# EAGLE design DOORLOCK_v2 (EAGLE 7.5.0)

## Sheet 1 of 2
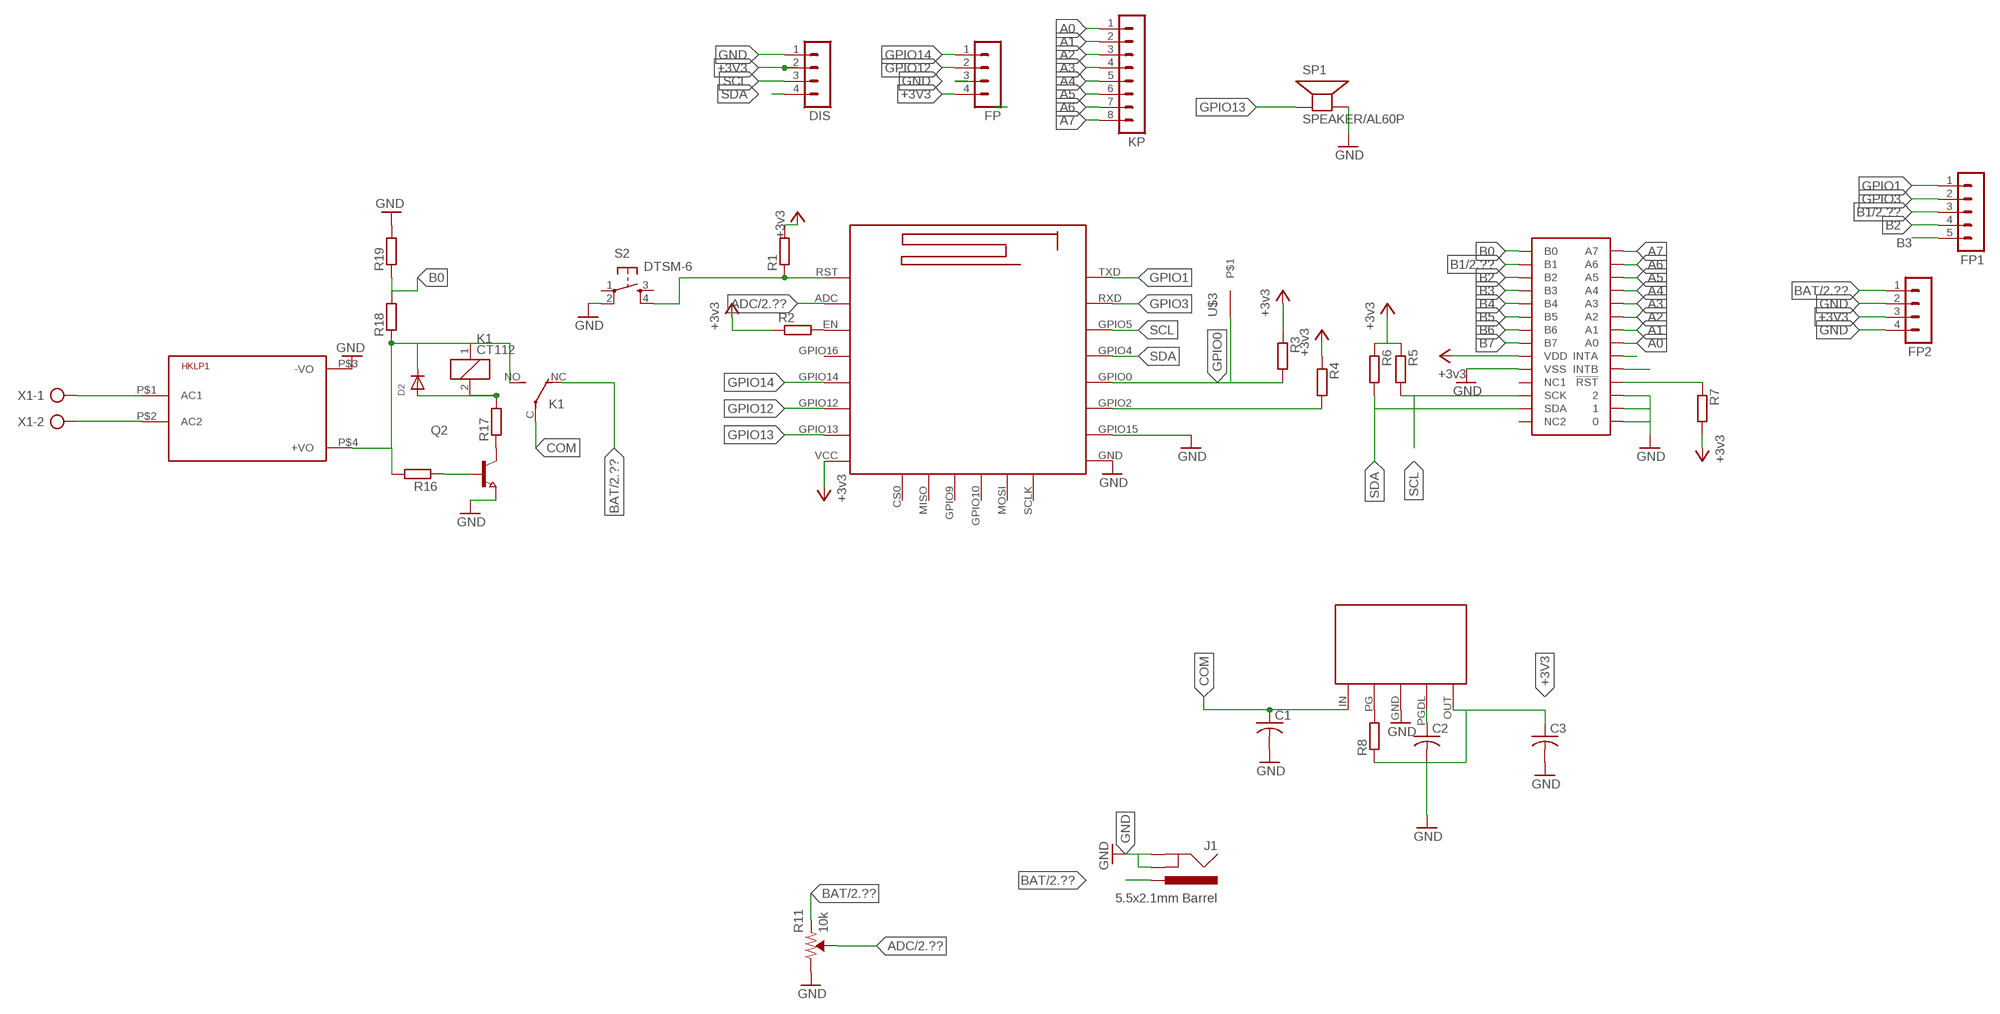
[diagram p0: schematic, sheet 1]

### Parts
C1  C-USC1206  [C1206]
C2  C-USC1206  [C1206]
C3  C-USC1206  [C1206]
D2  DIODESOD-123  [SOD-123]
DIS  MA04-1  [MA04-1]
FP  MA04-1  [MA04-1]
FP1  MA05-1  [MA05-1]
FP2  MA04-1  [MA04-1]
HKLP1  HKLPM01  [HKLPM01]
J1  5.5x2.1mm Barrel  POWER_JACKSMD  [POWER_JACK_SMD]
K1  CT112  [CT-SLIM]
KP  MA08-1  [MA08-1]
Q2  NPN-TRANSISTOR_SOT89  [SOT89]
R1  R-EU_0204/2V  [0204V]
R2  R-EU_0204/2V  [0204V]
R3  R-EU_0204/2V  [0204V]
R4  R-EU_0204/2V  [0204V]
R5  R-EU_0204/2V  [0204V]
R6  R-EU_0204/2V  [0204V]
R7  R-EU_0204/2V  [0204V]
R8  R-EU_0204/2V  [0204V]
R11  10k  TRIMPOT-SMD-3MM-OPEN-1/10W-25%  [TRIMPOT-SMD-TC33X]
R16  R-EU_0204/2V  [0204V]
R17  R-EU_0204/2V  [0204V]
R18  R-EU_0204/2V  [0204V]
R19  R-EU_0204/2V  [0204V]
S2  DTSM-6  [DTSM-6]
SP1  SPEAKER/AL60P  [AL60P]
U$1  ESP12E  [ESP-12E]
U$2  MCF23017  [MAX23017]
U$3  M1  [M1]
U$4  MP2014  [MP2014]
X1  AK500/2-H  [AK500/2-H]

### Nets
+3V3 [GPIO]: C3.1 DIS.2 FP2.3 FP.4 R1.2 R2.1 R3.1 R4.1 R5.1 R6.1 R7.2 R8.1 U$1.VCC U$2.P$9(VDD) U$4.OUT ; supply symbol labelled +3v3
+12V: D2.C HKLP1.P$4(+VO) K1.1 K1.NO(2:S) R16.2 R18.1 ; also sheet 2
A0 [GPIO]: KP.1 U$2.P$21(A0)
A1 [GPIO]: KP.2 U$2.P$22(A1)
A2 [GPIO]: KP.3 U$2.P$23(A2)
A3 [GPIO]: KP.4 U$2.P$24(A3)
A4 [GPIO]: KP.5 U$2.P$25(A4)
A5 [GPIO]: KP.6 U$2.P$26(A5)
A6 [GPIO]: KP.7 U$2.P$27(A6)
A7 [GPIO]: KP.8 U$2.P$28(A7)
ADC [GPIO]: R11.2(WIPER) U$1.ADC ; also sheet 2
B0 [GPIO]: R18.2 R19.1 U$2.P$1(B0)
B1 [GPIO]: FP1.3 U$2.P$2(B1) ; also sheet 2
B2 [GPIO]: FP1.4 U$2.P$3(B2)
B3 [GPIO]: FP1.5 U$2.P$4(B3)
B4 [GPIO]: U$2.P$5(B4)
B5 [GPIO]: U$2.P$6(B5)
B6 [GPIO]: U$2.P$7(B6)
B7 [GPIO]: U$2.P$8(B7)
BAT [GPIO]: FP2.1 J1.VIN0(PWR) K1.NC(2:O) R11.3(CCW) ; also sheet 2
COM: C1.1 K1.C(2:P) U$4.IN
GND [GPIO]: C1.2 C2.2 C3.2 DIS.1 FP2.2 FP2.4 FP.3 HKLP1.P$3(-VO) J1.GND(GNDBREAK) J1.P$4(GND) Q2.3(E) R11.1(CW) R19.2 S2.2 SP1.2(-) U$1.GND U$1.GPIO15 U$2.P$10(VSS) U$2.P$15 U$2.P$16 U$2.P$17 U$4.GND ; also sheet 2
GPIO0 [GPIO]: R3.2 U$1.GPIO0 U$3.P$1
GPIO1 [GPIO]: FP1.1 U$1.TXD
GPIO3 [GPIO]: FP1.2 U$1.RXD
GPIO12 [GPIO]: FP.2 U$1.GPIO12
GPIO13 [GPIO]: SP1.1(+) U$1.GPIO13
GPIO14 [GPIO]: FP.1 U$1.GPIO14
N$1 [GPIO]: R1.1 S2.4 U$1.RST
N$2: R2.2 U$1.EN
N$3 [AC]: HKLP1.P$1(AC1) X1.1
N$4 [GPIO]: R4.2 U$1.GPIO2
N$7 [AC]: HKLP1.P$2(AC2) X1.2
N$9: R7.1 U$2.P$18(!RST)
N$10: U$2.P$19(INTB)
N$11: U$2.P$20(INTA)
N$12: R8.2 U$4.PG
N$13: C2.1 U$4.PGDL
N$15: Q2.1(B) R16.1
N$16: Q2.2(C) R17.1
N$26: D2.A K1.2 R17.2
SCL [GPIO]: DIS.3 R5.2 U$1.GPIO5 U$2.P$12(SCK)
SDA [GPIO]: DIS.4 R6.2 U$1.GPIO4 U$2.P$13(SDA)
Unconnected: S2.1 S2.3 U$1.CS0 U$1.GPIO9 U$1.GPIO10 U$1.GPIO16 U$1.MISO U$1.MOSI U$1.SCLK U$2.P$11(NC1) U$2.P$14(NC2)

## Sheet 2 of 2
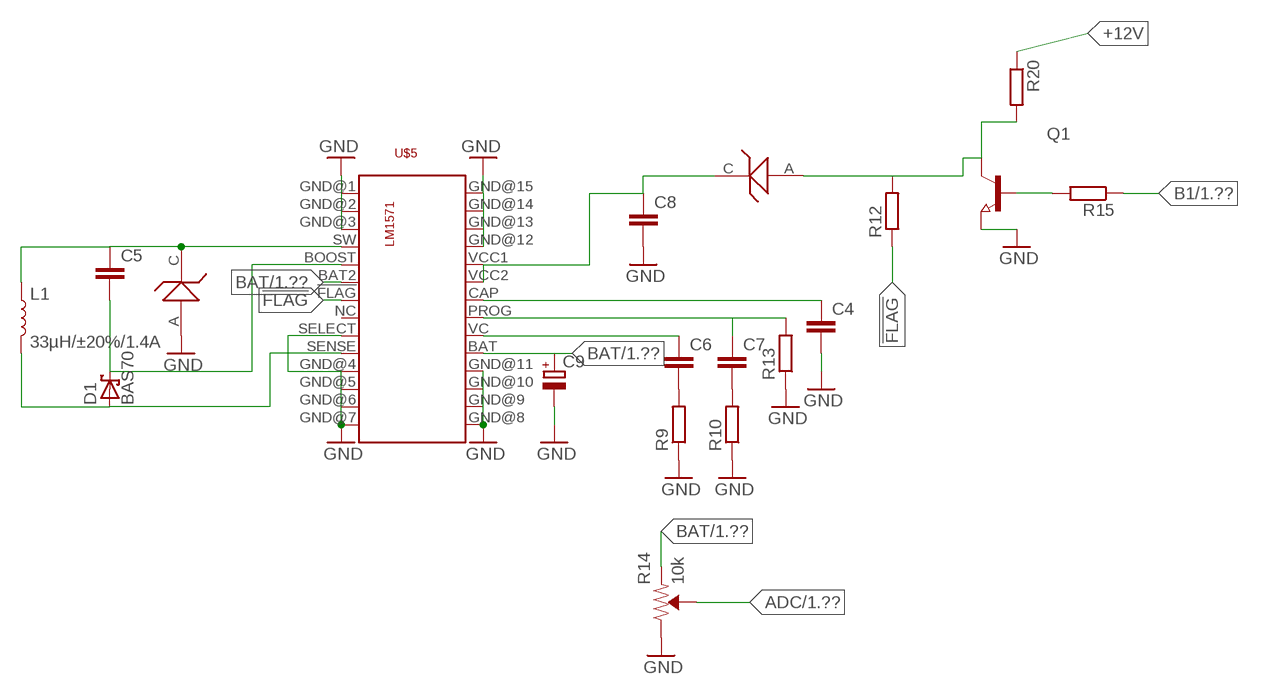
[diagram p1: schematic, sheet 2]

### Parts
C4  C-EUC0805  [C0805]
C5  C-EUC0805  [C0805]
C6  C-EUC0805  [C0805]
C7  C-EUC0805  [C0805]
C8  C-EUC0805  [C0805]
C9  CPOL-EUCT3216  [CT3216]
D1  BAS70  [SOT23]
D3  MBRM120T3  [MBRM120T3]
L1  33µH/±20%/1.4A  INDUCTOR-SRN6045-33UH  [SRN6045]
Q1  NPN-TRANSISTOR_SOT89  [SOT89]
R9  R-EU_0204/2V  [0204V]
R10  R-EU_0204/2V  [0204V]
R12  R-EU_0204/2V  [0204V]
R13  R-EU_0204/2V  [0204V]
R14  10k  TRIMPOT-SMD-3MM-OPEN-1/10W-25%  [TRIMPOT-SMD-TC33X]
R15  R-EU_0204/2V  [0204V]
R20  R-EU_0204/2V  [0204V]
U$5  LM1571  [LT1571]
U$6  MBRM120T3  [MBRM120T3]

### Nets
!FLAG [GPIO]: R12.1 U$5.!FLAG
+12V: R20.1 ; also sheet 1
ADC [GPIO]: R14.2(WIPER) ; also sheet 1
B1 [GPIO]: R15.1 ; also sheet 1
BAT [GPIO]: C9.+ R14.3(CCW) U$5.BAT U$5.BAT2 ; also sheet 1
GND [GPIO]: C4.2 C8.2 C9.- Q1.3(E) R9.1 R10.1 R13.1 R14.1(CW) U$5.GND@1 U$5.GND@2 U$5.GND@3 U$5.GND@4 U$5.GND@5 U$5.GND@6 U$5.GND@7 U$5.GND@8 U$5.GND@9 U$5.GND@10 U$5.GND@11 U$5.GND@12 U$5.GND@13 U$5.GND@14 U$5.GND@15 U$5.SELECT U$6.A ; also sheet 1
N$8 [GPIO]: Q1.1(B) R15.2
N$14: C8.1 D3.C U$5.VCC1 U$5.VCC2
N$17 [GPIO]: C4.1 U$5.CAP
N$18: D3.A Q1.2(C) R12.2 R20.2
N$19: D1.1(A) L1.2 U$5.SENSE
N$20: C5.1 L1.1 U$5.SW U$6.C
N$21: C5.2 D1.3(C) U$5.BOOST
N$22: C6.2 R9.2
N$23: C6.1 U$5.VC
N$24: C7.2 R10.2
N$25: C7.1 R13.2 U$5.PROG
Unconnected: U$5.NC

## Library data of the parts
C1-C3 = adafruit:C-US: CAPACITOR, American symbol
C4-C8 = rcl:C-EU: CAPACITOR, European symbol
C9 = rcl:CPOL-EU: POLARIZED CAPACITOR, European symbol
D1 = diode:BAS70: Silicon Schottky Diodes General-purpose diode for high-speed switching
D2 = adafruit:DIODE: Diode SMADIODE - SMA Surface Mount Package 20V 1A Schottky Diode Digikey: 641-1014-6-ND DO-1N4148 - Through Hole Small Current Diode SOD-123 20V 1 A (.5mV Vf) Schottky Diode - Digikey: MBRX120TPMSCT-ND SOD-323 10V 570mA (.38mV Vf, 3ns) Schottky Diode - Digikey: ZLLS410CT-ND SOD-523 30V 30mA Schottky Diode (RB751S-40TE61) - Digikey: RB751S-40TE61CT-ND SOT23-R/W - SOT23 Package (R = Solder Paste/Reflow Ovens, W = Hand-Soldering) BAT54Film 40V 300mA - Digikey: 497-7162-1-ND
D3 U$6 = Alfred:MBRM120T3
DIS FP FP2 = con-lstb:MA04-1: PIN HEADER; OC_FARNELL: unknown; OC_NEWARK: unknown
FP1 = con-lstb:MA05-1: PIN HEADER; OC_FARNELL: unknown; OC_NEWARK: unknown
HKLP1 = HKLPM01:HKLPM01
J1 = SparkFun-Connectors:POWER_JACK: Power Jack Connector This is the standard 5.5mm barrel jack for power. The PTH is the most common, proven, reliable, footprint. The Slot footprint only works if the mill layer is transmitted to the PCB fab house so be warned. Here are the connectors we sell at SparkFun: DC Barrel Power Jack/Connector <https://www.sparkfun.com/products/119> (PRT-00119) DC Barrel Power Jack/Connector (SMD) <https://www.sparkfun.com/products/12748> (PRT-12748) DC Barrel Jack Adapter - Breadboard Compatible <https://www.sparkfun.com/products/10811> (PRT-10811) It is used on this SparkFun product (and many, many others): SparkFun RedBoard - Programmed with Arduino <https://www.sparkfun.com/products/12757> (DEV-12757) Also, if you need a mating power supply or connector, please check these out: Wall Adapter Power Supply - 9VDC 650mA <https://www.sparkfun.com/products/298> (TOL-00298) DC Barrel Jack Adapter - Male <https://www.sparkfun.com/products/10287> (PRT-10287); PROD_ID: CONN-08106; SF_ID: PRT-12748
K1 = relay:CT112: ULTRA SMALL AUTOMOTIVE RELAY NAiS Slim 1c type en_ds_61205_0000.pdf; OC_FARNELL: unknown; OC_NEWARK: unknown
KP = con-lstb:MA08-1: PIN HEADER; OC_FARNELL: unknown; OC_NEWARK: unknown
L1 = SparkFun-Coils:INDUCTOR: Inductors Resist changes in electrical current. Basically a coil of wire. SparkFun Products: SparkFun Load Cell Amplifier - HX711 <https://www.sparkfun.com/products/13879> IOIO-OTG - V2.2 <https://www.sparkfun.com/products/13613>; PROD_ID: NDUC-11627
Q1 Q2 = semicon-smd-ipc:NPN-TRANSISTOR_: NPN TRANSISTOR
R1-R8 R16-R19 = resistor:R-EU_: RESISTOR, European symbol
R9 R10 R12 R13 R15 R20 = rcl:R-EU_: RESISTOR, European symbol
R11 R14 = SparkFun-Resistors:TRIMPOT: Trimming Potentiometer (Trimpot) Three-terminal potentiometers, with an adjustable wiper and two adjustable resistors. A pot can be used to create a configurable voltage divider, or as a variable resistor. "Trimpots" are a subset of potentiometers, usually intended for "set-and-forget" applications. They're often more delicate than standard potentiometers - rated for fewer turns. Variants PTH-KNOB - PTH Trimpot w/ finger-adjustable knob Trimpot 10K with Knob <https://www.sparkfun.com/products/9806> (COM-09806) Datasheet <http://www.sparkfun.com/datasheets/Components/General/TSR-3386.pdf> SMD-3MM-CLOSED-FRAME - SMD 3mm Square Closed-Frame Trimpot Used on e.g. EasyDriver - Stepper Motor Driver <https://www.sparkfun.com/products/12779> Datasheet <http://www.bitechnologies.com/pdfs/22.pdf> (22AR10KTR) SMD-5MM - SMD 5mm Square Closed-Frame Trimpot Used on e.g. IOIO-OTG - V2.2 <https://www.sparkfun.com/products/13613> Datasheet <http://www.vishay.com/docs/51008/ts53.pdf> (TS53YL502MR10) SMD-3MM-1/10W-25% - 3mm Square Open-Frame Trimpot Used on e.g. SparkFun Shapeoko <https://www.sparkfun.com/products/13899> Datasheet <http://www.bourns.com/docs/Product-Datasheets/TC33.pdf> (TC33X-2-103E); PROD_ID: RES-12428, RES-08048
S2 = switch-tact:DTSM-6
SP1 = adafruit:SPEAKER: SPEAKER Source: Buerklin Added PS12 (for part # PS1240 piezo) http://www.ladyada.net/library/pcb/eaglelibrary.html
U$1 = Alfred:ESP12E
U$2 = Alfred:MCF23017
U$3 = Alfred:M1
U$4 = Alfred:MP2014
U$5 = Alfred:LM1571
X1 = con-ptr500:AK500/2-H: CONNECTOR Aug. 2004 / PTR Meßtechnik: Die Bezeichnung der Serie AK505 wurde geändert. Es handelt sich hierbei um AK500 in horizontaler Ausführung.; OC_FARNELL: unknown; OC_NEWARK: unknown

## Net classes
0 default: width 0.5 mm, drill 0.4 mm, clearance 0.2 mm
1 AC: width 1 mm, drill 0.4 mm, clearance 1 mm to class 0, clearance 1 mm
2 GPIO: width 0.2 mm, drill 0.4 mm, clearance 0.2 mm to class 0, clearance 1 mm to class 1, clearance 0.2 mm

## Board
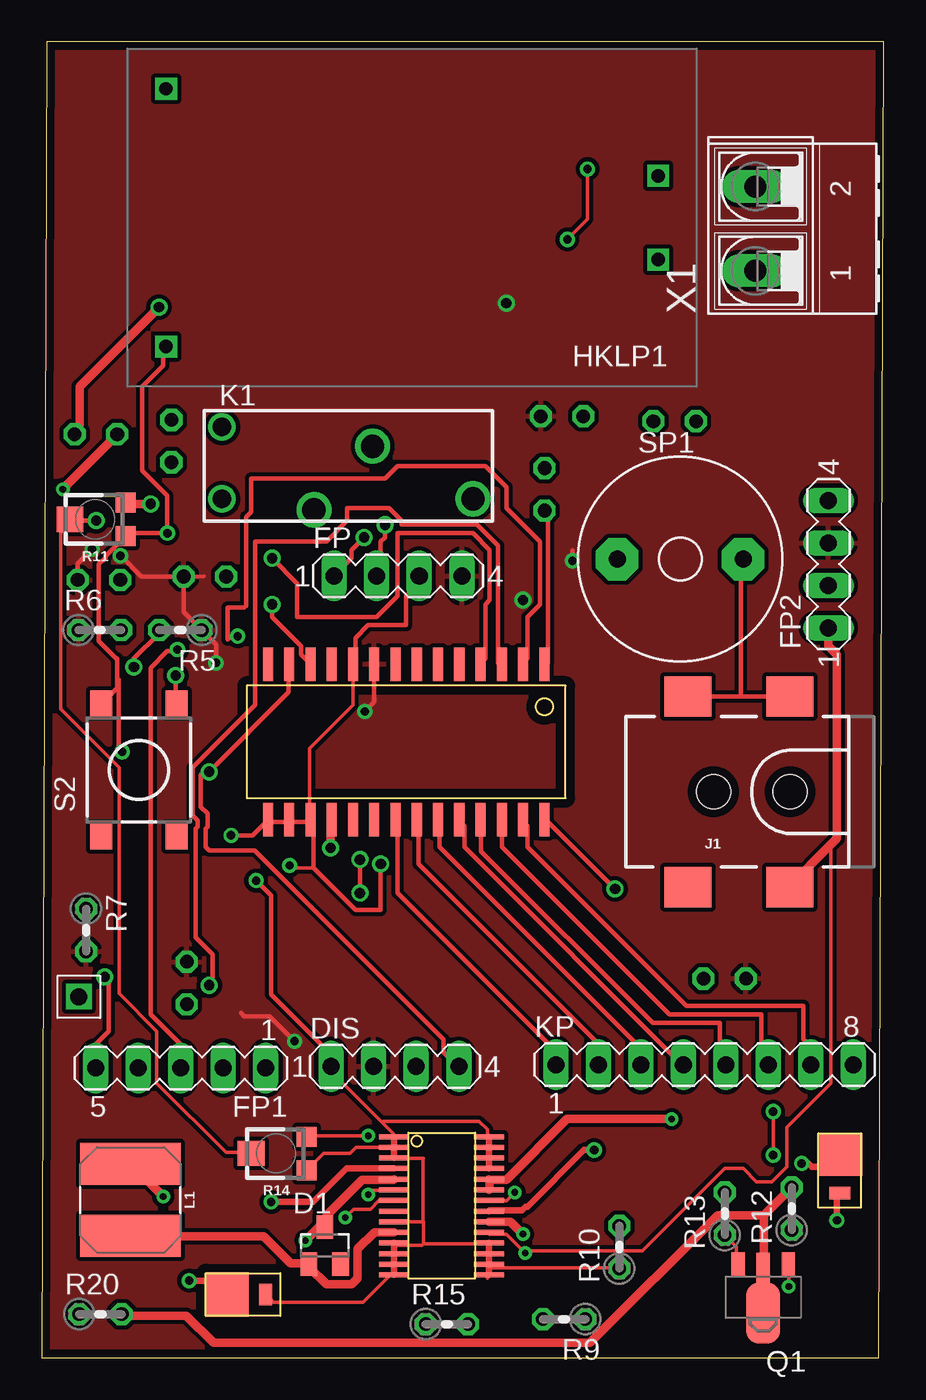
[diagram p2: board, top side]
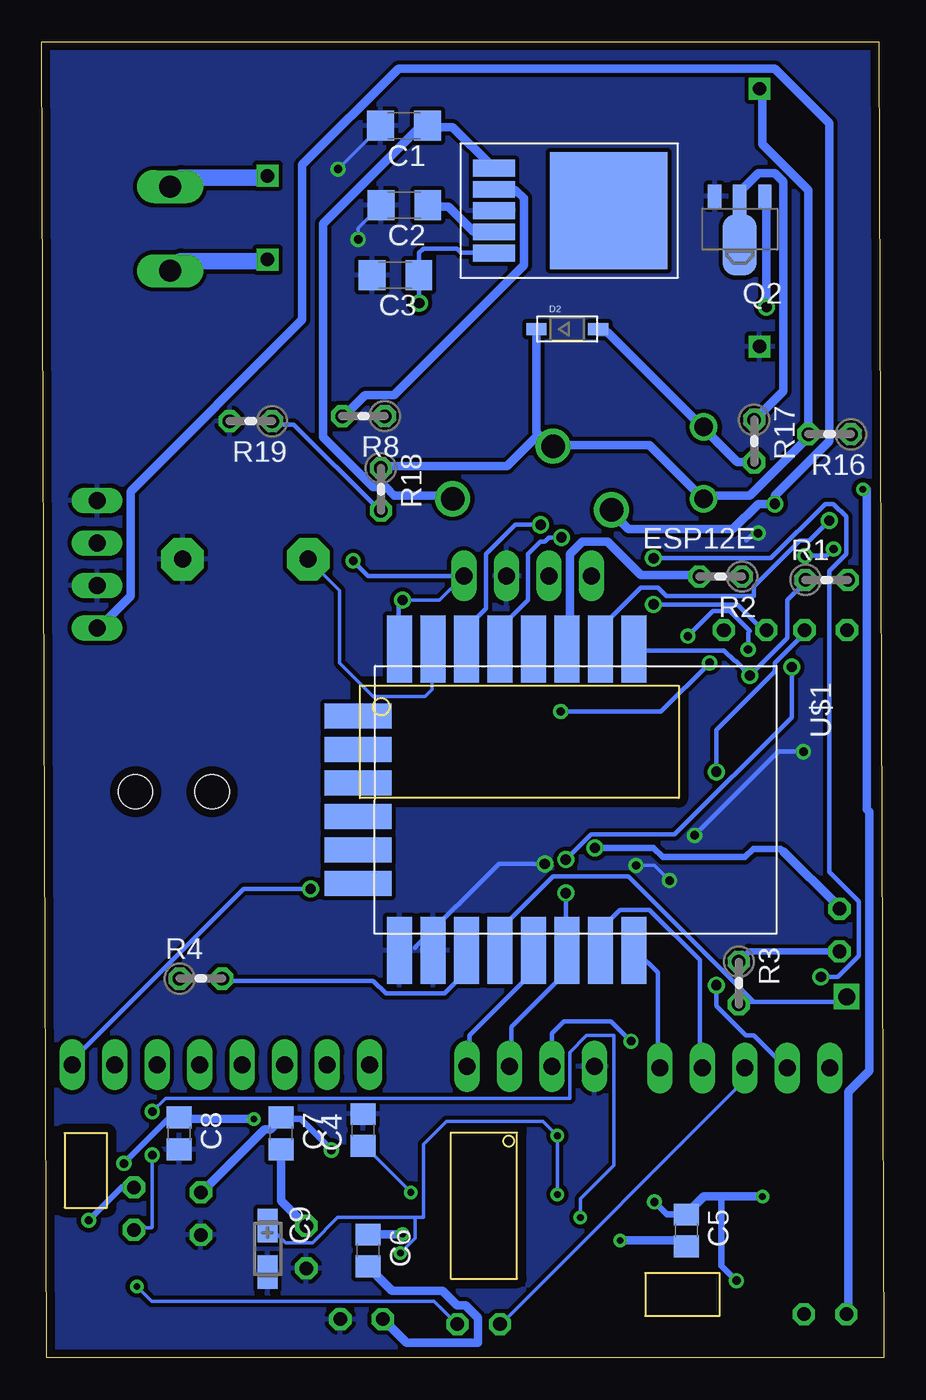
[diagram p3: board, bottom side, seen from below]

Size 50.3 x 78.6 mm. Coordinates in mm from the lower left corner, seen from the top.
Outline: 0,0 50,0 50.3,78.6 0.3,78.6 0,0
Copper layers (1*16): Top 0.035mm / dielectric 1.5mm / Bottom 0.035mm
Design rules "default *": minimum track width 0.2mm, minimum drill 0.4mm, track to track 0.2mm, track to pad 0.2mm, pad to pad 0.2mm, via to via 0.2mm, smd to smd 8mil, copper to edge 0.5mm, drill to drill 8mil, minimum pad ring 10mil, minimum via ring 8mil, stop-mask expansion 4mil, vias tented up to drill 0mil, thermal gap 10mil
Holes 3 mm at 59,75 66,72

### Footprints (pad centres in the part's own frame; a part is rotated, then mirrored left to right if it is on the bottom)
C1206 = smd 1.6 x 1.8: 1 -1.4,0; 2 1.4,0
C0805 = smd 1.3 x 1.5: 1 -0.95,0; 2 0.95,0
CT3216 = smd 2 x 1.2: + -1.4,0; - 1.4,0
SOT23 = smd 1 x 1.4: 1 -0.95,-1.1; 2 0.95,-1.1; 3 0,1.1
SOD-123 = smd 1.2 x 0.7: A 1.85,0; C -1.85,0
MBRM120T3 = smd 0.762 x 1.27: A 3.575,1.27 | smd 2.54 x 2.67: C 1.27,1.27
MA04-1 = drill 1.016 long: 1 -3.81,0; 2 -1.27,0; 3 1.27,0; 4 3.81,0
MA05-1 = drill 1.016 long: 1 -5.08,0; 2 -2.54,0; 3 0,0; 4 2.54,0; 5 5.08,0
HKLPM01 = drill 0.8 square: P$1 -14.7,2.5; P$2 -14.7,-2.5; P$3 14.7,7.7; P$4 14.7,-7.7
POWER_JACK_SMD = smd 2.8 x 2.4: GND 0,-5.7; P$4 6.1,-5.7; VIN0 0,5.7; VIN1 6.1,5.7 | hole 2.032: 0,0; 4.572,0
CT-SLIM = drill 1.1: 1 -7.45,0; 2 -7.45,4.3 | drill 1.4: C 7.55,0; NC -1.95,-0.65; NO 1.55,3.15
MA08-1 = drill 1.016 long: 1 -8.89,0; 2 -6.35,0; 3 -3.81,0; 4 -1.27,0; 5 1.27,0; 6 3.81,0; 7 6.35,0; 8 8.89,0
SRN6045 = smd 2.5 x 6: 1 -2.175,0; 2 2.125,0
SOT89 = smd 0.8 x 1.4: 1 -1.499,-1.981; 3 1.499,-1.981 | smd 0.8 x 1.9: 2 0,-1.727 | smd 2.032 x 3.65: 2@1 0,0.94
0204V = drill 0.813 octagon: 1 -1.27,0; 2 1.27,0
TRIMPOT-SMD-TC33X = smd 1.2 x 1.2: 1 -1,-1.825; 3 1,-1.825 | smd 1.5 x 1.6: 2 0,1.5
DTSM-6 = smd 1.55 x 1.3: 1 -3.975,2.25; 2 3.975,2.25; 3 -3.975,-2.25; 4 3.975,-2.25
AL60P = drill 1.016 pad 2.54 octagon: 1 -3.759,0; 2 3.759,0
ESP-12E = smd 4 x 1.5: ADC -1,13.48; EN -1,11.48; GND 17,1.48; GPIO0 17,7.48; GPIO2 17,5.48; GPIO4 17,9.48; GPIO5 17,11.48; GPIO12 -1,5.48; GPIO13 -1,3.48; GPIO14 -1,7.48; GPIO15 17,3.48; GPIO16 -1,9.48; RST -1,15.48; RXD 17,13.48; TXD 17,15.48; VCC -1,1.48 | smd 1.5 x 4: CS0 3,-1; GPIO9 7,-1; GPIO10 9,-1; MISO 5,-1; MOSI 11,-1; SCLK 13,-1
MAX23017 = smd 0.6 x 2: P$1 0,0; P$2 1.27,0; P$3 2.54,0; P$4 3.81,0; P$5 5.08,0; P$6 6.35,0; P$7 7.62,0; P$8 8.89,0; P$9 10.16,0; P$10 11.43,0; P$11 12.7,0; P$12 13.97,0; P$13 15.24,0; P$14 16.51,0; P$15 16.51,9.3; P$16 15.24,9.3; P$17 13.97,9.3; P$18 12.7,9.3; P$19 11.43,9.3; P$20 10.16,9.3; P$21 8.89,9.3; P$22 7.62,9.3; P$23 6.35,9.3; P$24 5.08,9.3; P$25 3.81,9.3; P$26 2.54,9.3; P$27 1.27,9.3; P$28 0,9.3
M1 = drill 1.016 square: P$1 0,0
MP2014 = smd 1 x 2.5: GND 0,0; IN -2.54,0; OUT 2.54,0; PG -1.27,0; PGDL 1.27,0 | smd 7 x 7: P$6 0,6.85
LT1571 = smd 0.3 x 1.8: !FLAG 3.81,-0.864; BAT 5.715,4.809; BAT2 3.175,-0.864; BOOST 2.54,-0.864; CAP 3.81,4.809; GND@1 0,-0.864; GND@2 0.635,-0.864; GND@3 1.27,-0.864; GND@4 6.35,-0.864; GND@5 6.985,-0.864; GND@6 7.62,-0.864; GND@7 8.255,-0.864; GND@8 8.255,4.809; GND@9 7.62,4.809; GND@10 6.985,4.809; GND@11 6.35,4.809; GND@12 1.905,4.809; GND@13 1.27,4.809; GND@14 0.635,4.809; GND@15 0,4.809; NC 4.445,-0.864; PROG 4.445,4.809; SELECT 5.08,-0.864; SENSE 5.715,-0.864; SW 1.905,-0.864; VC 5.08,4.809; VCC1 2.54,4.809; VCC2 3.175,4.809
AK500/2-H = drill 1.321 long: 1 -2.515,0; 2 2.515,0

### Placement (x,y rotation side)
C1  28.66,73.59 180 bottom
C2  28.64,68.84 180 bottom
C3  29.18,64.66 180 bottom
C4  31.1,13.6 90 bottom
C5  11.8,7.6 270 bottom
C6  30.8,6.4 270 bottom
C7  36,13.4 270 bottom
C8  42.1,13.4 270 bottom
C9  36.8,6.5 270 bottom
D1  16.9,6.7 0 top
D2  18.91,61.44 0 bottom
D3  46.4,13.4 270 top
DIS  21.1,17.4 0 top
FP  21.28,46.7 0 top
FP1  8.3,17.3 180 top
FP2  47,47.4 90 top
HKLP1  22.12,68.1 180 top
J1  44.7,33.8 180 top
K1  18.21,51.3 0 top
KP  39.6,17.5 0 top
L1  5.3,9.4 270 top
Q1  43.1,3.6 180 top
Q2  8.6,67.4 180 bottom
R1  3.41,46.46 0 bottom
R2  9.74,46.66 180 bottom
R3  8.66,22.38 270 bottom
R4  40.8,22.64 0 bottom
R5  8.28,43.46 180 top
R6  3.46,43.46 0 top
R7  2.64,25.54 270 top
R8  31.08,56.24 180 bottom
R9  31.2,2.3 180 top
R10  34.5,6.6 90 top
R11  3.18,50.08 90 top
R12  44.8,8.9 90 top
R13  40.8,8.6 90 top
R14  14,12.2 90 top
R15  24.2,2 0 top
R16  3.23,55.16 180 bottom
R17  7.74,54.75 270 bottom
R18  30.04,51.87 270 bottom
R19  37.81,55.94 180 bottom
R20  3.5,2.6 0 top
S2  5.8,35.1 90 top
SP1  38.14,47.7 0 top
U$1  30.41,41.32 270 bottom
U$2  30.02,41.42 180 top
U$3  2.21,21.56 180 top
U$4  23.29,68.52 270 bottom
U$5  21.9,13.2 270 top
U$6  9.8,2.5 0 top
X1  42.63,67.44 90 top

### Tracks (layer width: path | path; a pad name or v marks a point on that pad's centre or on a via)
!FLAG  (via drill 0.4, 0.5)
  Top 0.2: v18.12,8.38 18.62,8.88 19.62,8.88 20.12,9.38 21,9.38 U$5.!FLAG | v43.7,12.1 v43.7,14.7
  Bottom 0.2: v18.12,8.38 18.12,9.5 16.12,11.5 16.12,19.25 17.75,19.25 18.75,18.25 18.75,15.5 42.9,15.5 v43.7,14.7 | R12.1 44.75,7.75 43.75,7.75 43.7,7.8 v43.7,12.1
+3V3  (via drill 0.5, 0.61)
  Top 0.2: R2.1 9.66,46.66 9.7,46.7 | R1.2 2.2,46.4
  Top 0.254: U$2.P$9 19.86,39.16 v19.3,38.6 | v10.4,41.5 10.4,42.61 R5.1 8.47,44.54 R2.1 5.94,46.66 v4.7,47.9 | v15.1,18.9 13.6,20.4 12.1,20.4 11.9,20.6 | v31.7,47.6 31.7,48.2 | v3,48.3 2.14,47.44 R1.2
  Bottom 0.2: v28.75,45.25 26.54,45.25 FP.4
  Bottom 0.254: U$4.OUT 23.5,66 25.25,66 25.5,66.25 27.5,66.25 27.75,66 27.75,64.75 C3.1 27.75,64.5 v27.75,63 | v28.75,45.25 29,45 29,42.5 U$1.VCC | v19.3,38.6 13.3,38.6 v10.4,41.5 | DIS.2 19.83,19.37 19.1,20.1 16.3,20.1 v15.1,18.9 | FP.4 30.8,46.7 v31.7,47.6 | v4.7,47.9 3.4,47.9 v3,48.3
  Bottom 0.4: R3.1 8.04,24.27 R7.2
  pour Top: 0.3,78.6 50.3,78.6 50,0 0,0
+12V  (via drill 0.4)
  Top 0.5: v1.25,51.88 4.5,55.12 R16.2
  Bottom 0.5: 20.62,55.12 20,54.5 K1.NO 19.5,54.5 14,54.5 11,51.5 K1.1 10.75,51.5 8,51.5 4.5,55 R16.2 4.5,69.75 7.25,72.5 7.25,75.75 HKLP1.P$4 | 20.62,55.12 20.75,55.25 20.75,61.25 D2.C | 20.62,55.12 22.5,53.25 30,53.25 R18.1 | v1.25,51.88 1,51.88 1,32.75 0.88,32.62 0.88,17.12 2.12,15.88 2.12,2.62 R20.1
A0
  Top 0.254: U$2.P$21 21.25,32 21.25,27.75 30.5,18.5 30.5,17.5 KP.1
A1
  Top 0.254: KP.2 33.25,18.75 22.5,29.5 22.5,32 U$2.P$22
A2
  Top 0.254: U$2.P$23 23.75,32 23.75,30.5 35.75,18.5 35.75,17.5 KP.3
A3
  Top 0.254: U$2.P$24 25,32 25.25,31.75 25.25,30.5 38.25,17.5 KP.4
A4
  Top 0.254: U$2.P$25 26.25,32 26.25,30.25 36.5,20 40.5,20 40.5,17.75 40.75,17.5 KP.5
A5
  Top 0.254: U$2.P$26 27.5,32 27.5,30.5 37.5,20.5 43,20.5 43,17.75 43.25,17.5 KP.6
A6
  Top 0.254: U$2.P$27 28.75,32 29,31.75 29,30.5 38.5,21 45.5,21 45.5,19 45.75,18.75 45.75,17.5 KP.7
A7  (via drill 0.61)
  Top 0.254: v34.25,28 30.25,32 U$2.P$28
  Bottom 0.254: v34.25,28 38.25,28 48.25,18 48.25,17.5 KP.8
ADC  (via drill 0.61)
  Top 0.2: R14.2 12.5,12.25 11,12.25 6.88,16.38 6.88,19.5 4.62,21.75 4.62,35.25 1.12,38.75 1.12,49.25 1.75,49.88 R11.2
  Top 0.254: v3.25,50 1.75,50 R11.2
  Bottom 0.254: U$1.ADC 16.75,42.5 16.75,43.75 14.5,46 13.5,46 13,45.5 7.75,45.5 7.75,46.05 5,48.8 4.45,48.8 v3.25,50
B0
  Top 0.254: U$2.P$1 30.25,41.5 30.25,50.5 R18.2
  Bottom 0.254: R19.1 36.5,55.75 35.25,55.75 30.25,50.75 R18.2
B1  (via drill 0.5)
  Top 0.254: U$2.P$2 28.75,41.5 29,41.75 29,44.25 29.75,45 29.75,48.75 27.75,50.75 27.75,52 26.5,53.25 21.25,53.25 20.5,52.5 12.5,52.5 12.5,50.5 12.2,50.2 12.2,44.9 12.1,44.8 11.1,44.8 11.1,42.9 11.3,43.1 v11.7,43.1 | FP1.3 8.25,17.5 8.25,18.75 6.5,20.5 6.5,41.2 7.5,42.2 8,42.2 v8.1,42.3
  Bottom 0.2: R15.1 22.88,2 8.38,16.5 8.38,17.25 FP1.3
  Bottom 0.254: v11.7,43.1 10.2,44.6 9.2,44.6 8,43.4 8.1,43.3 v8.1,42.3
B2  (via drill 0.61)
  Top 0.254: 10.25,22.5 v10,22.25 10.2,22.45 10.2,24.1 9.2,25.1 9.2,31.6 9.3,31.7 9.3,32.1 9,32.4 9,35.25 12.75,39 12.75,48.75 17,48.75 18.25,50 18.25,50.75 20.75,50.75 21.5,50 21.5,49.75 26,49.75 27.25,48.5 27.25,41.5 U$2.P$3
  Bottom 0.254: v10,22.25 10,21 8.25,19.25 7.75,19.25 6,17.5 FP1.4
B3  (via drill 0.61)
  Top 0.254: v13.75,47.75 15.25,46.25 15.25,44.25 20,44.25 21.25,45.5 21.25,49.25 25.75,49.25 26.75,48.25 26.75,45.25 26.5,45 26.5,41.75 26.25,41.5 U$2.P$4 | v3.75,22.75 4,22.5 4,19.5 3,18.5 3,17.5 FP1.5
  Bottom 0.254: v13.75,47.75 6.75,47.75 3.5,51 3,51 2.25,50.25 2.25,48 3.25,47 3.25,29 1.5,27.25 1.5,24 2.75,22.75 v3.75,22.75
BAT  (via drill 0.4, 0.61)
  Top 0.2: v19.5,13.25 15.88,13.25 R14.3 | U$5.BAT 26.75,7.38 27.75,7.38 v28.88,6.25 28.88,6.38 35.88,6.38 40.8,11.3 41.9,11.3 42.7,10.5 43.6,10.5 44.5,11.4 44.5,13.75 47.12,16.38 47.12,30.38 47,30.5 | v19.5,9.75 19.75,10 21,10 U$5.BAT2
  Top 0.5: v6.5,51 5.25,51 R11.3 | FP2.1 47,42.5 47.5,42 47.5,31 47,30.5 44.75,28.25 J1.VIN0
  Bottom 0.2: 28,8.38 32.62,8.38 34.12,6.88 35.75,6.88 36.75,7.88 C9.+ | 28,8.38 27.5,8.38 27.5,12.75 26.12,14.12 20.38,14.12 v19.5,13.25 v19.5,9.75 | v28.88,6.25 28,7.12 28,8.38
  Bottom 0.5: K1.NC 16.25,50.5 15.25,49.5 9,49.5 7.5,51 v6.5,51 6.5,51.5 3.25,54.75 3.25,73.75 6.5,77 29,77 34.75,71.25 34.75,62 45,51.75 45,45.5 47,43.5 FP2.1
COM
  Bottom 0.5: U$4.IN 23.5,71.25 25.75,73.5 27.25,73.5 C1.1 27.5,73.75 33.5,67.75 33.5,55 30.5,52 29.75,52 29.25,51.5 26,51.5 K1.C
GND  (via drill 0.5, 0.61)
  Top 0.2: U$2.P$17 16,32.17 16,36.4 18.59,38.99 U$2.P$10 | v14.8,29.4 14.95,29.25 16.25,29.25 | v31.4,66.8 32.6,68 v32.6,71 | 4.5,40 4.5,40.4 4.6,40.5 | U$5.GND@8 26.62,4.75 26.7,4.83 26.7,6.9 26.6,6.8 22.8,6.8 | Q1.3 41.5,5.62 41.5,6.62 40.88,7.25 R13.1 | 20.88,12.62 U$5.GND@2 18.77,12.56 18.4,12.2 16.82,12.2 R14.1 | 20.31,14.06 21,13.38 U$5.GND@1 | 20.31,14.06 17.38,17 17.38,17.38 DIS.1 | 26.71,5.38 34.5,5.38 R10.1 | U$5.GND@15 26.62,13.38 26.62,13.62 26.12,14.12 20.38,14.12 20.31,14.06 | U$5.GND@4 21.19,6.7 22.7,6.7 22.8,6.8 | 22.8,6.8 22.8,8.1 22.78,8.12 | 22.78,8.12 U$5.SELECT | U$6.A 13.85,3.3 19.2,3.3 20.84,4.95 U$5.GND@7 | U$5.GND@3 21.07,11.9 22.8,11.9 22.78,11.88 22.78,8.12
  Top 0.254: J1.GND 41.75,39.5 | 41.75,39.5 J1.P$4 | v7.5,49.25 5.25,49.25 R11.1 3.8,47.88 3.8,47.8 3.4,47.4 3.4,42.8 4.45,41.75 4.5,41.75 4.5,40 3.75,39.25 S2.2 | v7.5,49.25 7.5,51.5 6,53 6,58 7.25,59.25 7.25,60.25 HKLP1.P$3 | U$2.P$10 18.75,41.5 18.75,43 19.5,43.75 21.75,43.75 21.75,45.5 22.5,46.25 22.5,46.5 FP.3 | v20.25,29.5 20.25,26.75 18.75,26.75 16.25,29.25 16.25,32 U$2.P$17 16,32 15,32 U$2.P$16 14.75,32 13.75,32 U$2.P$15 12.59,31.2 v11.3,31.2 | 41.75,39.5 41.75,47.5 SP1.2 | 4.6,40.5 4.6,36.4 v4.8,36.2 | v12.8,28.5 13.7,27.6 13.7,21.7 17.29,18.11 DIS.1 | v7.5,49.25 7.85,49.25
  Top 0.4: U$5.GND@8 26.71,5.38 U$5.GND@9 U$5.GND@10 U$5.GND@11 | U$5.GND@7 U$5.GND@6 U$5.GND@5 U$5.GND@4 | U$5.GND@1 U$5.GND@2 U$5.GND@3 | U$5.GND@15 U$5.GND@14 U$5.GND@13 U$5.GND@12
  Bottom 0.2: v12.8,28.5 13.7,29.4 v14.8,29.4 | C2.2 31.4,67.48 v31.4,66.8 | v32.6,71 30.06,73.54 C1.2
  Bottom 0.254: v20.25,29.5 23,29.5 28,24.5 28,24.47 | v4.8,36.2 6.3,36.2 v11.3,31.2 | v7.5,49.25 7.75,49.25 8.2,48.8
  pour Bottom: 0,78.4 50,78.4 50,0 0,0
GPIO0
  Bottom 0.254: 7.75,21.25 2.5,21.25 2.25,21.5 U$3.P$1 | 7.75,21.25 8.5,21.25 R3.2 | 7.75,21.25 15.25,28.75 19.75,28.75 22.75,25.75 22.75,24.5 U$1.GPIO0
GPIO1
  Bottom 0.254: FP1.1 13.5,17.5 13.5,23 14.75,24.25 U$1.TXD
GPIO3
  Bottom 0.254: FP1.2 11,17.5 11,23.75 14,26.75 15.75,26.75 16.75,25.75 16.75,24.5 U$1.RXD
GPIO12  (via drill 0.61)
  Top 0.254: v20.5,49.75 20.5,49 20.25,48.75 20.25,46.75 FP.2
  Bottom 0.254: v20.5,49.75 22,49.75 23.75,48 23.75,44.75 24.75,43.75 24.75,42.5 U$1.GPIO12
GPIO13
  Bottom 0.2: 27,42.5 27,39.9 27.4,39.5 30.5,39.5 32.5,41.5 32.5,45.82 SP1.1
  Bottom 0.254: 27,42.5 U$1.GPIO13
GPIO14  (via drill 0.61)
  Top 0.254: v19.25,49 18.5,48.25 18.5,47.75 17.5,46.75 FP.1
  Bottom 0.254: v19.25,49 20,49 20.25,48.75 20.5,48.75 21.25,48 21.25,45.25 22.75,43.75 22.75,42.5 U$1.GPIO14
N$1  (via drill 0.61)
  Top 0.254: v8,40.75 8,39.25 S2.4
  Bottom 0.254: R1.1 4.75,46.25 5.75,45.25 5.75,43 v8,40.75 8.85,41.6 8.9,41.6 9.55,42.25 14.75,42.25 U$1.RST
N$2
  Bottom 0.5: R2.2 11.25,46.75 14.5,46.75 16.5,48.75 18,48.75 18.75,48 18.75,42.5 U$1.EN
N$3
  Bottom 1: HKLP1.P$1 37,65.5 42,65.5 42.5,65 X1.1
N$4
  Bottom 0.254: R4.2 39.5,22.5 30.5,22.5 29.75,21.75 26.25,21.75 25,23 25,24.25 U$1.GPIO2
N$7
  Bottom 1: HKLP1.P$2 37,70.5 42,70.5 42.5,70 X1.2
N$8  (via drill 0.4)
  Top 0.2: v44.62,4.25 44.62,5.5 Q1.1
  Bottom 0.2: v44.62,4.25 43.75,3.38 26.88,3.38 25.5,2 R15.2
N$9  (via drill 0.61)
  Top 0.5: v17.25,30.45 17.25,32 U$2.P$18
  Bottom 0.4: v17.25,30.45 13.75,30.45 13.2,29.9 8.3,29.9 7.8,30.4 6.15,30.4 6,30.25
  Bottom 0.5: 6,30.25 2.75,27 R7.1
N$12
  Bottom 0.5: U$4.PG 23.25,69.75 22,69.75 21.5,69.25 21.5,65.25 29.25,57.5 31,57.5 32.25,56.25 R8.2
N$13
  Bottom 0.5: U$4.PGDL 24.5,67.25 26,68.75 27,68.75 C2.1
N$14  (via drill 0.4, 0.5)
  Top 0.4: D3.C 47.6,12.2 46.8,11.4 46,11.4 45.8,11.6 v45.4,11.6
  Top 0.5: v37.62,14.25 31.38,14.25 27.75,10.62 26.75,10.62 | 26.75,10.62 U$5.VCC1 | U$5.VCC2 26.75,10.12 26.75,10.62
  Bottom 0.4: v45.4,11.6 42.65,14.35 C8.1
  Bottom 0.5: v37.62,14.25 42,14.25 C8.1
N$15  (via drill 0.61)
  Top 0.5: v7,62.75 2.25,58 2.25,55.75 2,55.5 2,55.25 R16.1
  Bottom 0.5: v7,62.75 7,69.25 Q2.1
N$16
  Bottom 0.5: Q2.2 8.5,69.25 8.5,69.75 7.5,70.75 6.5,70.75 6,70.25 6,57.75 7.5,56.25 R17.1
N$17  (via drill 0.4)
  Top 0.2: v28.25,9.88 27.75,9.38 26.75,9.38 U$5.CAP
  Bottom 0.2: v28.25,9.88 31,12.62 C4.1
N$18  (via drill 0.5)
  Top 0.4: D3.A 47.5,9.65 v47.5,8.2
  Top 0.5: 43.12,8.5 43.12,5.38 Q1.2 | 43.12,8.5 44.75,10.12 R12.2 | 43.12,8.5 40.38,8.5 32.75,0.88 10.25,0.88 8.62,2.5 4.88,2.5 R20.2
  Bottom 0.4: v47.5,8.2 45.53,10.17 R12.2
N$19
  Top 0.5: L1.2 5.38,7.25 13.25,7.25 14.88,5.62 15.88,5.62 D1.1 16,5.38 17,4.38 18.5,4.38 18.88,4.75 18.88,6.5 19.88,7.5 21,7.5 U$5.SENSE
N$20  (via drill 0.4, 0.5)
  Top 0.4: v13.7,9.3 16.2,9.3 18.2,11.29 U$5.SW | U$6.C 10.24,4.6 v8.8,4.6
  Top 0.5: L1.1 v7.25,9.62
  Bottom 0.4: C5.1 12.95,8.55 v13.7,9.3 | v8.8,4.6 9.7,5.5 9.7,9.62
  Bottom 0.5: v7.25,9.62 9.7,9.62 10.75,9.62 11.75,8.62 C5.1
N$21  (via drill 0.4)
  Top 0.5: U$5.BOOST 21,10.62 19.12,10.62 17,8.5 17,7.88 D1.3 16.88,8.12 v15.75,7
  Bottom 0.5: v15.75,7 12.12,7 11.88,6.75 C5.2
N$22
  Bottom 0.5: C6.2 30.75,5.38 29.38,4 26.38,4 25.5,3.12 25,3.12 24.25,2.38 24.25,0.88 28.5,0.88 29.88,2.25 R9.2
N$23  (via drill 0.4)
  Top 0.5: v28.75,7.38 28,8.12 26.75,8.12 U$5.VC
  Bottom 0.5: v28.75,7.38 30.75,7.38 C6.1
N$24
  Bottom 0.5: C7.2 36,9.38 R10.2
N$25  (via drill 0.5)
  Top 0.4: v33,12.4 32.4,12.4 29,9 28.9,9 28.7,8.8 26.75,8.8 U$5.PROG
  Bottom 0.4: 36,14.25 34.85,14.25 v33,12.4
  Bottom 0.5: C7.1 36,14.25 36.62,13.62 37,13.62 40.75,9.88 R13.2
N$26
  Bottom 0.5: D2.A 17,61.25 16.5,61.25 11,55.75 K1.2 10.75,55.5 8.75,53.5 7.75,53.5 R17.2
SCL  (via drill 0.61)
  Top 0.254: v13.75,45 13.75,44.25 15.5,42.5 15.5,42 16,41.5 U$2.P$12 | v5.5,41.25 5.5,41.75 7,43.25 R5.2 | v19,27.75 v19,29.75
  Bottom 0.254: v13.75,45 8.75,45 7.25,43.5 R5.2 | DIS.3 22.25,17.5 22.25,19.75 19,23 19,24.25 U$1.GPIO5 19,24.5 v19,27.75 | v5.5,41.25 5.5,38.25 12.5,31.25 17.5,31.25 v19,29.75
SDA  (via drill 0.61)
  Top 0.254: v10,35 10.25,35.25 | U$2.P$13 14.75,41.5 14.75,39.75 v10,35 | DIS.4 24.75,17.5 24,18.25 24,19 12.7,30.3 10,30.3 9.8,30.5 9.8,31.6 9.9,31.7 9.9,32.5 9.5,32.9 9.5,34.8 9.7,35 v10,35
  Bottom 0.254: DIS.4 24.75,17.5 24.75,19.25 21,23 21,24.25 U$1.GPIO4 | v10,35 10,37.5 6.5,41 6.5,41.5 4.75,43.25 R6.2